# Altium project SmartHaloDD.PrjPcb
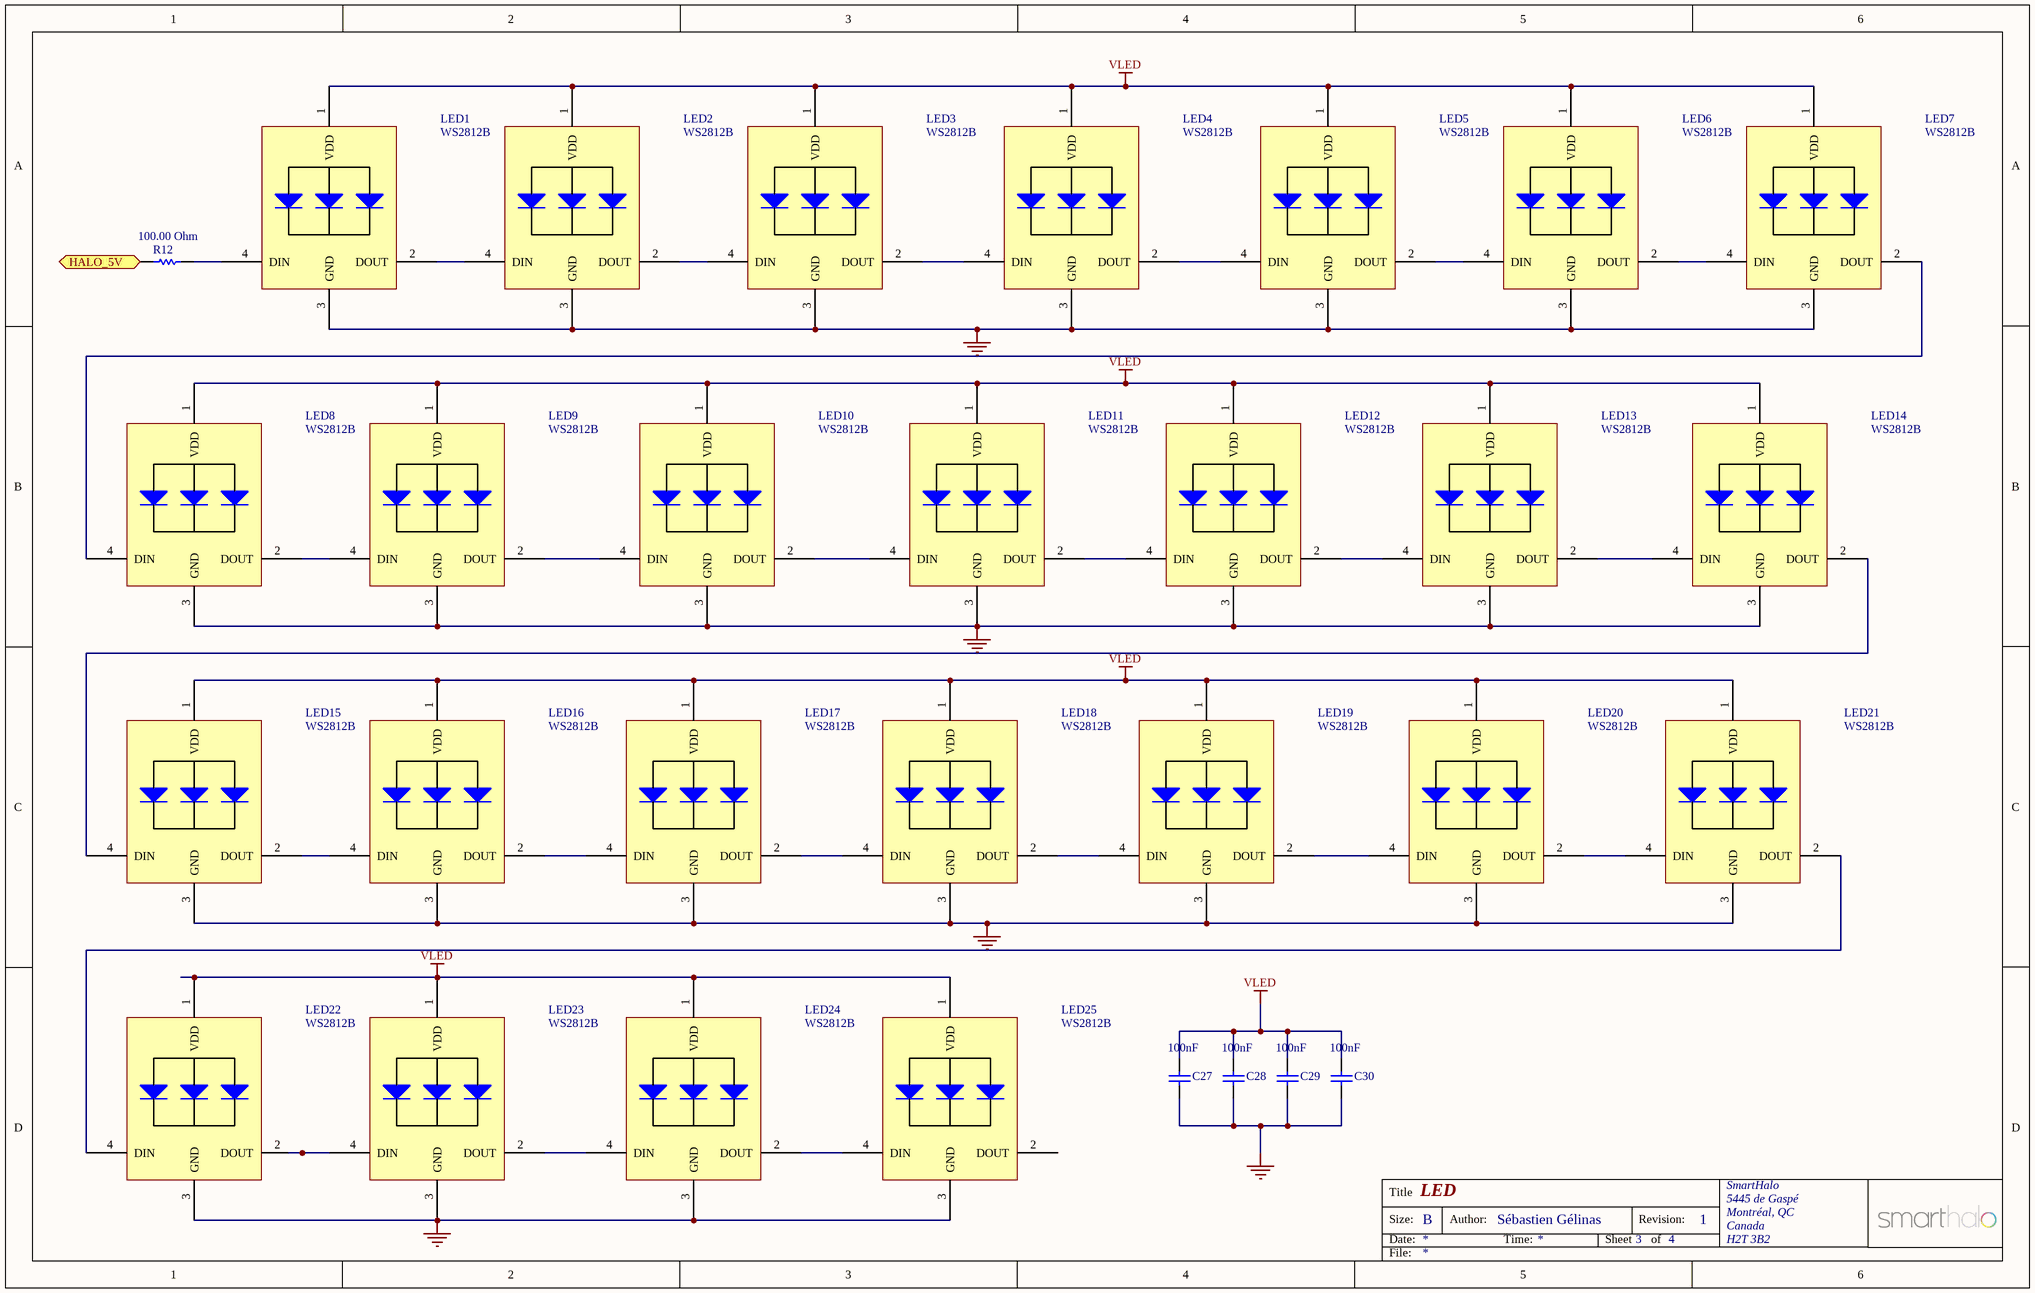
[diagram p0: LED.SchDoc]
2 sheets, 73 parts. Net scope: flat (ports and power ports of the same name join across sheets).
Board file: SmartHaloDD.PcbDoc
Sheets:
  LED.SchDoc
  PWR.SchDoc

## Sheet LED.SchDoc: LED
size B; Author: Sébastien Gélinas; Organization: SmartHalo; Address1: 5445 de Gaspé; Address2: Montréal, QC; Address3: Canada; Address4: H2T 3B2; DocumentNumber: 3; Revision: 1; SheetNumber: 3; SheetTotal: 4

### Parts
C27  Capacitance: 100nF  [CAPC0402(1005)60_L]  (hidden comment: CAP 100nF 10V 0402(1005))
C28  Capacitance: 100nF  [CAPC0402(1005)60_L]  (hidden comment: CAP 100nF 10V 0402(1005))
C29  Capacitance: 100nF  [CAPC0402(1005)60_L]  (hidden comment: CAP 100nF 10V 0402(1005))
C30  Capacitance: 100nF  [CAPC0402(1005)60_L]  (hidden comment: CAP 100nF 10V 0402(1005))
LED1  WS2812B  [WS2812B5050]
LED2  WS2812B  [WS2812B5050]
LED3  WS2812B  [WS2812B5050]
LED4  WS2812B  [WS2812B5050]
LED5  WS2812B  [WS2812B5050]
LED6  WS2812B  [WS2812B5050]
LED7  WS2812B  [WS2812B5050]
LED8  WS2812B  [WS2812B5050]
LED9  WS2812B  [WS2812B5050]
LED10  WS2812B  [WS2812B5050]
LED11  WS2812B  [WS2812B5050]
LED12  WS2812B  [WS2812B5050]
LED13  WS2812B  [WS2812B5050]
LED14  WS2812B  [WS2812B5050]
LED15  WS2812B  [WS2812B5050]
LED16  WS2812B  [WS2812B5050]
LED17  WS2812B  [WS2812B5050]
LED18  WS2812B  [WS2812B5050]
LED19  WS2812B  [WS2812B5050]
LED20  WS2812B  [WS2812B5050]
LED21  WS2812B  [WS2812B5050]
LED22  WS2812B  [WS2812B5050]
LED23  WS2812B  [WS2812B5050]
LED24  WS2812B  [WS2812B5050]
LED25  WS2812B  [WS2812B5050]
R12  Resistance: 100.00 Ohm  [RESC0402(1005)_L]  (hidden comment: 100R ±5% 0402(1005))

### Ports
HALO_5V (in)

### Nets
GND: C27.1 C28.1 C29.1 C30.1 LED1.3(GND) LED2.3(GND) LED3.3(GND) LED4.3(GND) LED5.3(GND) LED6.3(GND) LED7.3(GND) LED8.3(GND) LED9.3(GND) LED10.3(GND) LED11.3(GND) LED12.3(GND) LED13.3(GND) LED14.3(GND) LED15.3(GND) LED16.3(GND) LED17.3(GND) LED18.3(GND) LED19.3(GND) LED20.3(GND) LED21.3(GND) LED22.3(GND) LED23.3(GND) LED24.3(GND) LED25.3(GND)
VLED: C27.2 C28.2 C29.2 C30.2 LED1.1(VDD) LED2.1(VDD) LED3.1(VDD) LED4.1(VDD) LED5.1(VDD) LED6.1(VDD) LED7.1(VDD) LED8.1(VDD) LED9.1(VDD) LED10.1(VDD) LED11.1(VDD) LED12.1(VDD) LED13.1(VDD) LED14.1(VDD) LED15.1(VDD) LED16.1(VDD) LED17.1(VDD) LED18.1(VDD) LED19.1(VDD) LED20.1(VDD) LED21.1(VDD) LED22.1(VDD) LED23.1(VDD) LED24.1(VDD) LED25.1(VDD)
NetLED1_2: LED1.2(DOUT) LED2.4(DIN)
NetLED1_4: LED1.4(DIN) R12.2
NetLED2_2: LED2.2(DOUT) LED3.4(DIN)
NetLED3_2: LED3.2(DOUT) LED4.4(DIN)
NetLED4_2: LED4.2(DOUT) LED5.4(DIN)
NetLED5_2: LED5.2(DOUT) LED6.4(DIN)
NetLED6_2: LED6.2(DOUT) LED7.4(DIN)
NetLED7_2: LED7.2(DOUT) LED8.4(DIN)
NetLED8_2: LED8.2(DOUT) LED9.4(DIN)
NetLED9_2: LED9.2(DOUT) LED10.4(DIN)
NetLED10_2: LED10.2(DOUT) LED11.4(DIN)
NetLED11_2: LED11.2(DOUT) LED12.4(DIN)
NetLED12_2: LED12.2(DOUT) LED13.4(DIN)
NetLED13_2: LED13.2(DOUT) LED14.4(DIN)
NetLED14_2: LED14.2(DOUT) LED15.4(DIN)
NetLED15_2: LED15.2(DOUT) LED16.4(DIN)
NetLED16_2: LED16.2(DOUT) LED17.4(DIN)
NetLED17_2: LED17.2(DOUT) LED18.4(DIN)
NetLED18_2: LED18.2(DOUT) LED19.4(DIN)
NetLED19_2: LED19.2(DOUT) LED20.4(DIN)
NetLED20_2: LED20.2(DOUT) LED21.4(DIN)
NetLED21_2: LED21.2(DOUT) LED22.4(DIN)
NetLED22_2: LED22.2(DOUT) LED23.4(DIN)
NetLED23_2: LED23.2(DOUT) LED24.4(DIN)
NetLED24_2: LED24.2(DOUT) LED25.4(DIN)
NetR12_1: R12.1 ; port HALO_5V

Not connected (* = marked no-connect by the designer): LED25 2(DOUT)

### Notes on the sheet
- Title
- Size:
- Date:
- B
- Author:
- Time:
- Sheet
- Revision:
- of
- File:

### Library data of the parts
C27-C30 = CMP-1034-02064-1: CAP 100nF 10V ±5% 0402 (1005 Metric); Case-EIA: 0402; Case-Metric: 1005; Tolerance: ±5%; Rated Voltage: 10 V
LED1-LED25 = WS2812B5050: IC RGB LED 5V SERIAL
R12 = CMP-1011-00050-1: 100R 0.063W ±5% 0402 (1005 Metric); Case-EIA: 0402; Case-Metric: 1005; Power: 0.063 W; Tolerance: ±5 %

## Sheet PWR.SchDoc: Power
size B; Author: Sébastien Gélinas; Organization: SmartHalo; Address1: 5445 de Gaspé; Address2: Montréal, QC; Address3: Canada; Address4: H2T 3B2; DocumentNumber: 1; Revision: 1; SheetNumber: 1; SheetTotal: 4
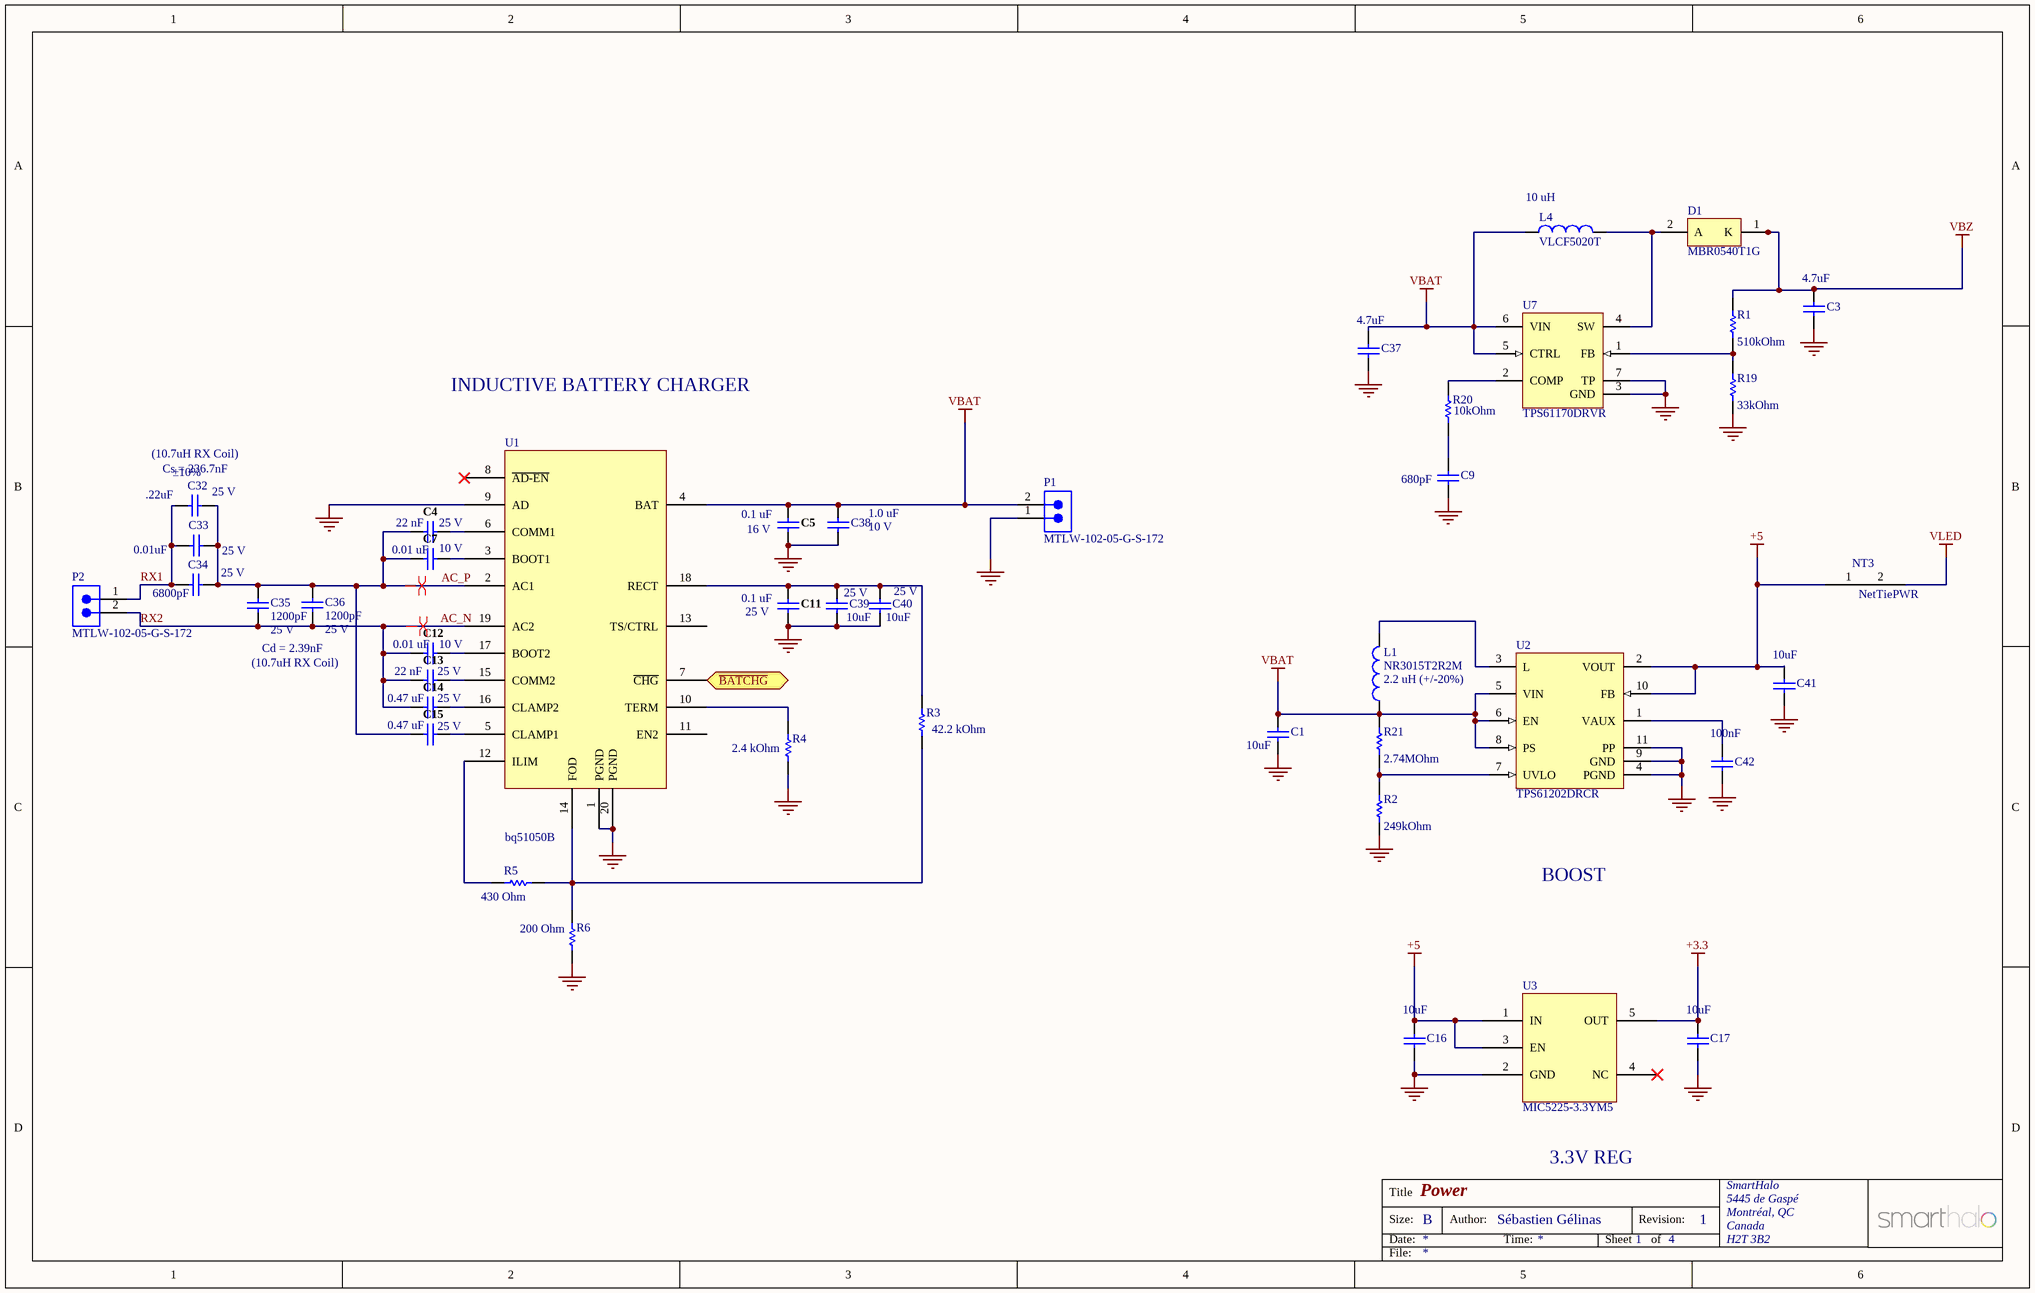
[diagram p1: PWR.SchDoc]

### Parts
C1  Capacitance: 10uF  [CAPC0603(1608)100_N]  (hidden comment: CAP 10uF 10V 0603(1608))
C3  Capacitance: 4.7uF  [CAPC0603(1608)100_N]  (hidden comment: CAP 4.7uF 10V 0603(1608))
C4  Rated Voltage: 25 V  Capacitance: 22 nF  [CAPC1005]  (hidden comment: CAP 0.22uF 25V 0402(1005))
C5  Rated Voltage: 16 V  Capacitance: 0.1 uF  [CAPC1005]  (hidden comment: CAP 0.1uF 16V 0402 (1005))
C7  Rated Voltage: 10 V  Capacitance: 0.01 uF  [CAPC1005]  (hidden comment: CAP 0.01uF 25V 0402 (1005))
C9  Capacitance: 680pF  [CAPC0402(1005)60_L]  (hidden comment: CAP 680pF 10V 0402(1005))
C11  Rated Voltage: 25 V  Capacitance: 0.1 uF  [CAPC1005]  (hidden comment: CAP 0.1uF 25V 0402 (1005))
C12  Rated Voltage: 10 V  Capacitance: 0.01 uF  [CAPC1005]  (hidden comment: CAP 0.01uF 25V 0402 (1005))
C13  Rated Voltage: 25 V  Capacitance: 22 nF  [CAPC1005]  (hidden comment: CAP 22 nF 25V 0402 (1005)
C14  Rated Voltage: 25 V  Capacitance: 0.47 uF  [CAPC1005]  (hidden comment: CAP 0.47uF 25V X7R 0402 (1005))
C15  Rated Voltage: 25 V  Capacitance: 0.47 uF  [CAPC1005]  (hidden comment: CAP 0.47uF 25V 0402 (1005))
C16  Capacitance: 10uF  [CAPC0805(2012)145_N]  (hidden comment: CAP 10uF 10V 0805(2012))
C17  Capacitance: 10uF  [CAPC0805(2012)145_N]  (hidden comment: CAP 10uF 10V 0805(2012))
C32  Tolerance: ±10%  Capacitance: .22uF  Rated Voltage: 25 V  [CAPC0402(1005)60_N]  (hidden comment: CAP 0.22uF 25V 0402(1005))
C33  Capacitance: 0.01uF  Rated Voltage: 25 V  [CAPC0402(1005)60_N]  (hidden comment: CAP 0.01uF 25V 0402(1005))
C34  Capacitance: 6800pF  Rated Voltage: 25 V  [CAPC0402(1005)60_N]  (hidden comment: CAP 6800pF 25V 0402(1005))
C35  value 1200pF  Rated Voltage: 25 V  [CAPC0402(1005)60_N]  (hidden comment: CAP 1200pF 25V 0402(1005))
C36  value 1200pF  Rated Voltage: 25 V  [CAPC0402(1005)60_N]  (hidden comment: CAP 1200pF 25V 0402(1005))
C37  Capacitance: 4.7uF  [CAPC0603(1608)100_N]  (hidden comment: CAP 4.7uF 10V 0603(1608))
C38  value 1.0 uF  Rated Voltage: 10 V  [CAPC0603(1608)100_N]  (hidden comment: CAP 1.0uF 10V 0603(1608))
C39  Rated Voltage: 25 V  Capacitance: 10uF  [CAPC0603(1608)100_N]  (hidden comment: CAP 10uF 25V 0603(1608))
C40  Rated Voltage: 25 V  Capacitance: 10uF  [CAPC0603(1608)100_N]  (hidden comment: CAP 10uF 25V 0603(1608))
C41  Capacitance: 10uF  [CAPC0603(1608)100_N]  (hidden comment: CAP 10uF 10V 0603(1608))
C42  Capacitance: 100nF  [CAPC0402(1005)60_L]  (hidden comment: CAP 100nF 10V 0402(1005))
D1  MBR0540T1G  [ONSC-SOD-123-2-425-04_V]
L1  NR3015T2R2M  Inductance: 2.2 uH (+/-20%)  [TAYO-IND0315_V]
L4  VLCF5020T  value 10 uH  [VLCF5020T-100M1R1-1]
NT3  NetTiePWR  [NetTiePWR]  (net tie, no BOM)
P1  MTLW-102-05-G-S-172  [SMTC-MTLW-102-05-X-S-172]  (no BOM)
P2  MTLW-102-05-G-S-172  [SMTC-MTLW-102-05-X-S-172]  (no BOM)
R1  Resistance: 510kOhm  [RESC0402(1005)_L]  (hidden comment: 510k ±1% 0402(1005))
R2  Resistance: 249kOhm  [RESC0402(1005)_N]  (hidden comment: 249K ±1% 0402(1005))
R3  Resistance: 42.2 kOhm  [RESC0402(1005)_M]  (hidden comment: 42K2 ±5% 0402(1005))
R4  Resistance: 2.4 kOhm  [RESC0402(1005)_M]  (hidden comment: 2k4 ±5% 0402(1005))
R5  Resistance: 430 Ohm  [RESC0402(1005)_M]  (hidden comment: 430R ±5% 0402(1005))
R6  Resistance: 200 Ohm  [RESC0402(1005)_M]  (hidden comment: 200R ±5% 0402(1005))
R19  Resistance: 33kOhm  [RESC0402(1005)_L]  (hidden comment: 33k ±1% 0402(1005))
R20  Resistance: 10kOhm  [RESC0402(1005)_L]  (hidden comment: 10k ±1% 0402(1005))
R21  Resistance: 2.74MOhm  [RESC0402(1005)_L]  (hidden comment: 2M74 ±1% 0402(1005))
U1  bq51050B  [RHL20-3050X2050TP]
U2  TPS61202DRCR  [DRC10-2400X1650TP]
U3  MIC5225-3.3YM5  [SOT23-5_N]
U7  TPS61170DRVR  [DRV6-1600X1000TP]

### Ports
~{BATCHG} (out)

### Nets
+3.3: C17.2 U3.5(OUT)
+5: C16.2 C41.2 NT3.1(NET1) U2.2(VOUT) U2.10(FB) U3.1(IN) U3.3(EN)
GND: C1.1 C3.1 C5.2 C9.1 C11.2 C16.1 C17.1 C37.1 C38.1 C39.1 C40.1 C41.1 C42.1 P1.1 R2.2 R4.1 R6.1 R19.1 U1.1(PGND) U1.9(AD) U1.20(PGND) U1.21(TP) U2.4(PGND) U2.9(GND) U2.11(PP) U3.2(GND) U7.3(GND) U7.7(TP)
VBAT: C1.2 C5.1 C37.2 C38.2 L1.1 L4.1 P1.2 R21.2 U1.4(BAT) U2.5(VIN) U2.6(EN) U2.8(PS) U7.5(CTRL) U7.6(VIN)
VBZ: C3.2 D1.1(K) R1.2
VLED: NT3.2(NET2)
AC_N: C12.1 C13.1 C14.1 C35.1 C36.1 P2.2 U1.19(AC2)  [also labelled RX2]
AC_P: C4.1 C7.1 C15.1 C32.2 C33.2 C34.2 C35.2 C36.2 U1.2(AC1)
RX1: C32.1 C33.1 C34.1 P2.1
NetC4_2: C4.2 U1.6(COMM1)
NetC7_2: C7.2 U1.3(BOOT1)
NetC9_2: C9.2 R20.1
NetC11_1: C11.1 C39.2 C40.2 R3.2 U1.18(RECT)
NetC12_2: C12.2 U1.17(BOOT2)
NetC13_2: C13.2 U1.15(COMM2)
NetC14_2: C14.2 U1.16(CLAMP2)
NetC15_2: C15.2 U1.5(CLAMP1)
NetC42_2: C42.2 U2.1(VAUX)
NetD1_2: D1.2(A) L4.2 U7.4(SW)
NetL1_2: L1.2 U2.3(L)
NetR1_1: R1.1 R19.2 U7.1(FB)
NetR2_1: R2.1 R21.1 U2.7(UVLO)
NetR3_1: R3.1 R5.2 R6.2 U1.14(FOD)
NetR4_2: R4.2 U1.10(TERM)
NetR5_1: R5.1 U1.12(ILIM)
NetR20_2: R20.2 U7.2(COMP)
NetU1_7: U1.7(~{CHG}) ; port ~{BATCHG}

Not connected (* = marked no-connect by the designer): U1 8(~{AD-EN})* 11(EN2) 13(TS/CTRL); U3 4(NC)*

### Layout directives
differential pair: AC_N, AC_P

### Notes on the sheet
- INDUCTIVE BATTERY CHARGER
- (near C32) (10.7uH RX Coil)
- (near C32) Cs = 236.7nF
- (10.7uH RX Coil)
- Cd = 2.39nF
- BOOST
- 3.3V REG
- Title
- Size:
- Date:
- B
- Author:
- Time:
- Sheet
- Revision:
- of
- File:

### Library data of the parts
C1 = CMP-1035-02799-1: CAP 10uF 10V ±10% 0603 (1608 Metric); Case-EIA: 0603; Case-Metric: 1608; Tolerance: ±10%; Rated Voltage: 10 V
C3 = CMP-1035-02799-1: CAP 4.7uF 10V ±10% 0603 (1608 Metric); Rated Voltage: 25 V; Case-EIA: 0603; Case-Metric: 1608; Tolerance: ±10%
C4 = CMP-0001-00074-1: CAP 0.22uF 25V ±10% 0402 (1005 Metric); Case-EIA: 0402; Case-Metric: 1005; Tolerance: 10 %
C5 = CMP-0001-00074-1: CAP 0.1uF 16V ±10% 0402 (1005 Metric); Case-EIA: 0402; Case-Metric: 1005; Tolerance: 10 %
C7 = CMP-0001-00074-1: CAP 0.01uF 25V ±10% 0402 (1005 Metric); Case-EIA: 0402; Case-Metric: 1005; Tolerance: 10 %
C9 = CMP-1034-02064-1: CAP 680pF 10V ±5% 0402 (1005 Metric); Case-EIA: 0402; Case-Metric: 1005; Tolerance: ±5%; Rated Voltage: 10 V
C11 = CMP-0001-00074-1: CAP 0.1uF 25V ±10% 0402 (1005 Metric); Case-EIA: 0402; Case-Metric: 1005; Tolerance: 10 %
C12 = CMP-0001-00074-1: CAP 0.01uF 10V ±10% 0402 (1005 Metric); Case-EIA: 0402; Case-Metric: 1005; Tolerance: 10 %
C13 = CMP-0001-00074-1: CAP 22 nF 25V ±10% 0402 (1005 Metric); Case-EIA: 0402; Case-Metric: 1005; Tolerance: 10 %
C14 = CMP-0001-00074-1: CAP 0.47 uF 25V ±10% X7R 0402 (1005 Metric); Case-EIA: 0402; Case-Metric: 1005; Tolerance: 10 %; Dielectric: X7R
C15 = CMP-0001-00074-1: CAP 0.47uF 25V ±10% 0402 (1005 Metric); Case-EIA: 0402; Case-Metric: 1005; Tolerance: 10 %
C16 C17 = CMP-1036-04922-1: CAP 10uF 10V ±10% 0805 (2012 Metric); Case-EIA: 0805; Case-Metric: 2012; Tolerance: ±10%; Rated Voltage: 10 V
C32 = CMP-1034-00958-1: CAP 0.22uF 25V ±10% 0402 (1005 Metric); Case-Metric: 1005; Case-EIA: 0402
C33 = CMP-1034-00958-1: CAP 0.01uF 25V ±10% 0402 (1005 Metric); Case-EIA: 0402; Case-Metric: 1005; Tolerance: ±10%
C34 = CMP-1034-00958-1: CAP 6800pF 25V ±10% 0402 (1005 Metric); Case-EIA: 0402; Case-Metric: 1005; Tolerance: ±10%
C35 C36 = CMP-1034-00958-1: CAP 1200pF 25V ±10% 0402 (1005 Metric); Case-EIA: 0402; Case-Metric: 1005; Tolerance: ±10%
C37 = CMP-1035-02799-1: CAP 4.7uF 10V ±10% 0603 (1608 Metric); Case-Metric: 1608; Case-EIA: 0603; Tolerance: ±10%; Rated Voltage: 10 V
C38 = CMP-1035-02799-1: CAP 1.0uF 10V ±10% 0603 (1608 Metric); Case-EIA: 0603; Case-Metric: 1608; Tolerance: ±10%
C39 C40 = CMP-1035-02799-1: CAP 10uF 25V ±10% 0603 (1608 Metric); Case-EIA: 0603; Case-Metric: 1608; Tolerance: ±10%
C41 = CMP-1035-02799-1: CAP 10uF 10V ±10% 0603 (1608 Metric); Case-Metric: 1608; Case-EIA: 0603; Tolerance: ±10%; Rated Voltage: 10 V
C42 = CMP-1034-02064-1: as C27 on sheet LED; Tolerance: ±5%; Rated Voltage: 10 V
D1 = CMP-1055-00401-1: Schottky Power Rectifier, 2-Pin SOD-123, Pb-Free, Tape and Reel; Manufacturer: On Semiconductor; IFSM Max (A): 5.5; Configuration: Single; ComponentLink1URL: http://www.onsemi.com/; ComponentLink3Description: Package Specification; RoHS: TRUE; PackageVersion: Rev. G, 10/2009; DatasheetVersion: Rev. 7; ComponentLink3URL: http://www.onsemi.com/pub_link/Collateral/425-04.PDF; Packing: Tape and Reel; ComponentLink1Description: Manufacturer URL; PackageDescription: 2-Pin SOD, Body 1.6 x 2.69 mm; PartNumber: MBR0540T1G; ComponentLink2Description: Datasheet; ComponentLink2URL: http://www.onsemi.cn/pub_link/Collateral/MBR0540T1-D.PDF; PackageReference: SOD-123-2-425-04; Mounting Technology: Surface Mount
L1 = CMP-0569-00001-1: SMD Power Inductor, 2.2 uH, +/-20%, 3 x 3 x 1.5 mm, -25 to 120 degC, Pb-Free, Tape and Reel; Manufacturer: Taiyo Yuden; Avg. of DC. Resistance: 0.06 Ohm; DC Resistance (max): 0.072 Ohm; Soldering Method: Reflow; Rated Current-Temperature Rise Current: 1500 mA; Self-Resonant Frequency (min): 64 MHz; Inductance Measuring Frequency: 100 kHz; Rated Current-Saturation Current: 1480 mA; DatasheetVersion: 1/11/2013; ComponentLink1Description: Manufacturer URL; Packing: Tape and Reel; ComponentLink1URL: www.yuden.co.jp; Case Size: 3015; PackageDescription: 2-Pin SMT Inductor, Body 3 x 3 mm; Mounting Technology: Surface Mount; Halogen Free: TRUE; PartNumber: NR3015T2R2M; PackageReference: IND3015; ComponentLink2URL: http://www.yuden.co.jp/ut/product/category/inductor/NR3015T2R2M.pdf; RoHS Compliance: TRUE; Temperature Range: -25 to 120 degC; ComponentLink2Description: Datasheet
L4 = VLCF5020T-100M1R1-1: FIXED IND 10UH 1.13A 237 MOHM
P1 = SMTC-MTLW-102-05-X-S-172: Low Profile .025" SQ Post Header, Through-hole, Vertical, -55 to 125 degC, 2.54 mm Pitch, 2-Pin, Male, RoHS; Manufacturer: Samtec; Pitch: 2.54 mm; ComponentLink2URL: http://www.samtec.com/documents/webfiles/pdf/MTLW_TH.PDF; PackageDescription: Low Profile Terminal Assembly; ComponentLink3URL: http://www.samtec.com/documents/webfiles/cpdf/MTLW-1XX-XX-XX-X-XXX-XX-XX-MKT1.pdf; PackageReference: MTLW-102-05-X-S-172; Mounting Technology: Through-hole; ComponentLink2Description: Datasheet; PackageVersion: T, 6/1991; Orientation: Vertical; DatasheetVersion: F-214; RoHS: True; ComponentLink3Description: Package Specification; ComponentLink1URL: http://www.samtec.com; Temperature Range: -55 to 125 degC; PartNumber: MTLW-102-05-G-S-172; ComponentLink1Description: Manufacturer URL
P2 = CMP-1024-00064-1: Low Profile .025" SQ Post Header, Through-hole, Vertical, -55 to 125 degC, 2.54 mm Pitch, 2-Pin, Male, RoHS; Manufacturer: Samtec; Pitch: 2.54 mm; ComponentLink2URL: http://www.samtec.com/documents/webfiles/pdf/MTLW_TH.PDF; PackageDescription: Low Profile Terminal Assembly; ComponentLink3URL: http://www.samtec.com/documents/webfiles/cpdf/MTLW-1XX-XX-XX-X-XXX-XX-XX-MKT1.pdf; PackageReference: MTLW-102-05-X-S-172; Mounting Technology: Through-hole; ComponentLink2Description: Datasheet; PackageVersion: T, 6/1991; Orientation: Vertical; DatasheetVersion: F-214; RoHS: True; ComponentLink3Description: Package Specification; ComponentLink1URL: http://www.samtec.com; Temperature Range: -55 to 125 degC; PartNumber: MTLW-102-05-G-S-172; ComponentLink1Description: Manufacturer URL
R1 = CMP-1011-00897-1: 510k 0.063W ±1% 0402 (1005 Metric); Case-EIA: 0402; Case-Metric: 1005; Tolerance: ±1 %; Power: 0.063 W
R2 = CMP-1011-00779-1: 249K 0.063W ±1% 0402 (1005 Metric); Case-EIA: 0402; Case-Metric: 1005; Power: 0.063 W; Tolerance: ±1 %
R3 = CMP-1011-00007-1: 42K2 0.063W ±5% 0402 (1005 Metric); Case-EIA: 0402; Case-Metric: 1005; Tolerance: ±5 %; Power: 0.063 W
R4 = CMP-1011-00007-1: 2k4 0.063W ±5% 0402 (1005 Metric); Case-EIA: 0402; Case-Metric: 1005; Tolerance: ±5 %; Power: 0.063 W
R5 = CMP-1011-00007-1: 430R 0.063W ±5% 0402 (1005 Metric); Case-EIA: 0402; Case-Metric: 1005; Tolerance: 5 %; Technology: SMT; Power: 0.063 W
R6 = CMP-1011-00007-1: 200R 0.063W ±5% 0402 (1005 Metric); Case-EIA: 0402; Case-Metric: 1005; Tolerance: ±5 %; Power: 0.063 W
R19 = CMP-1011-00897-1: 33k 0.063W ±1% 0402 (1005 Metric); Case-EIA: 0402; Case-Metric: 1005; Tolerance: ±1 %; Power: 0.063 W
R20 = CMP-1011-00897-1: 10k 0.063W ±1% 0402 (1005 Metric); Case-EIA: 0402; Case-Metric: 1005; Tolerance: ±1 %; Power: 0.063 W
R21 = CMP-1011-00897-1: 2M74 0.063W ±1% 0402 (1005 Metric); Case-EIA: 0402; Case-Metric: 1005; Tolerance: ±1 %; Power: 0.063 W
U1 = bq51051B: IC WIRELESS PWR RCVR 20QFN
U2 = CMP-0343-00055-1: Boost Voltage Converter with 0.3 to 5.5 V Input and 5 V Output, -40 to 85 degC, 10-Pin SON (DRC), Green (RoHS & no Sb/Br); Manufacturer: Texas Instruments; Vout(Min)(V): 5; Vin(Min)(V): 0.3; Synchronous Rectification: TRUE; SubFamily: Step-Up Regulator; Vin(Max)(V): 5.5; Regulated Outputs(#): 1; Switching Frequency(Max)(kHz): 1250; DatasheetVersion: SLVS577B; Eco-Plan: Green (RoHS & no Sb/Br); PackageVersion: revL, Sep-2011; ComponentLink1Description: Datasheet; ComponentLink1URL: http://www.ti.com/general/docs/lit/getliterature.tsp?genericPartNumber=TPS61202&fileType=pdf; PartNumber: TPS61202DRCR; Vout(Max)(V): 5; Topology: Boost; ComponentLink2Description: Package Specification; Mounting Technology: Surface Mount; PackageDescription: 10-Pin Plastic Small Outline No-Lead, 3 x 3 x 1 mm Body, 0.5 mm Pitch, Exposed Pad; PackageReference: DRC10-2400X1650TP; Preset Vout(V): 5; ComponentLink2URL: http://www.ti.com/litv/pdf/mpds117k
U3 = MIC5225-3.3YM5: IC REG LDO 3.3V 0.15A SOT23-5
U7 = CMP-0347-00039-1: Boost Voltage Converter with 3 to 18 V Input and 3 to 38 V Output, -40 to 85 degC, 6-Pin SON (DRC), Green (RoHS & no Sb/Br); Manufacturer: Texas Instruments; Regulated Outputs(#): 1; Vout(Min)(V): 3; SubFamily: Step-Up Regulator; Dynamic Voltage Scaling: TRUE; Vin(Max)(V): 18; Switching Frequency(Max)(kHz): 1200; Vout(Max)(V): 38; Eco-Plan: Green (RoHS & no Sb/Br); Topology: Boost; ComponentLink1Description: Datasheet; DatasheetVersion: SLVS789C; ComponentLink2URL: http://www.ti.com/litv/pdf/mpds216d; PackageReference: DRV6-1600X1000TP; PartNumber: TPS61170DRVR; ComponentLink1URL: http://www.ti.com/general/docs/lit/getliterature.tsp?genericPartNumber=TPS61170&fileType=pdf; PackageVersion: revE, Oct-2010; Mounting Technology: Surface Mount; Vin(Min)(V): 3; ComponentLink2Description: Package Specification; PackageDescription: 6-Pin Plastic Small Outline No-Lead, 2 x 2 x 0.8 mm Body, 0.65 mm Pitch, Exposed Pad

## Nets that join several sheets
GND: LED (29 pins), PWR (28 pins)
VLED: LED (29 pins), PWR (NT3.2)